# EAGLE design CMoy - OPA1622 (EAGLE 6.4)
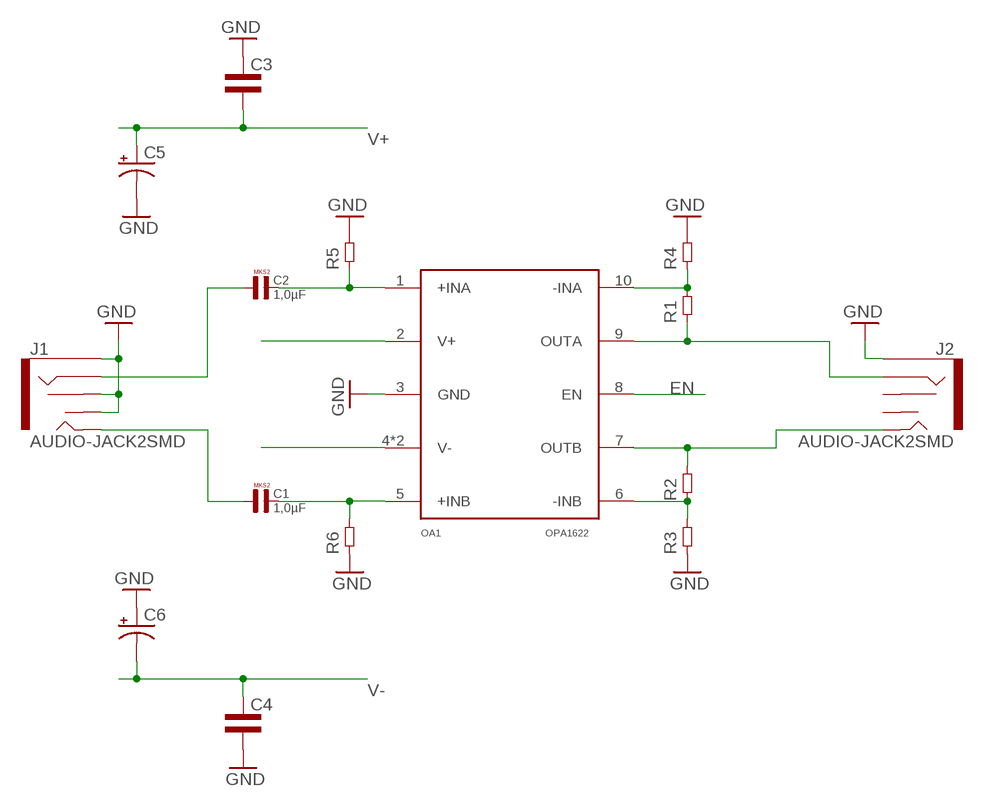
[diagram p0: schematic, sheet 1]

## Parts
C1  1,0µF  [R5B5]
C2  1,0µF  [R5B5]
C3  CAP0402L3  [0402L3]
C4  CAP0402L3  [0402L3]
C5  CPOL-USE5-10.5  [E5-10,5]
C6  CPOL-USE5-10.5  [E5-10,5]
J1  AUDIO-JACK2SMD  [AUDIO-JACK-3.5MM-SMD]
J2  AUDIO-JACK2SMD  [AUDIO-JACK-3.5MM-SMD]
OA1  OPA1622  [S-PVSON-N10]
R1  RES0402L3  [0402L3]
R2  RES0402L3  [0402L3]
R3  RES0402L3  [0402L3]
R4  RES0402L3  [0402L3]
R5  RES0402L3  [0402L3]
R6  RES0402L3  [0402L3]

## Nets
EN: OA1.8(EN)
GND: C3.P$1 C4.P$2 C5.- C6.+ J1.RSH J1.SLEEVE J1.TSH J2.SLEEVE OA1.3(GND) R3.P$1 R4.P$2 R5.P$2 R6.P$1
N$2: C1.2 OA1.5(+INB) R6.P$2
N$3: C2.2 OA1.1(+INA) R5.P$1
N$4: OA1.10(-INA) R1.P$2 R4.P$1
N$5: OA1.6(-INB) R2.P$1 R3.P$2
N$6: J2.TIP OA1.7(OUTB) R2.P$2
N$7: J2.RING OA1.9(OUTA) R1.P$1
N$11: C1.1 J1.TIP
N$12: C2.1 J1.RING
V+: C3.P$2 C5.+ OA1.2(V+)
V-: C4.P$1 C6.- OA1.4(V-) OA1.TP(V-)
Unconnected: J2.RSH J2.TSH

## Library data of the parts
C1 C2 = Capacitor-Wima-MKS2-63v:1,0µF
C3 C4 = common:CAP
C5 C6 = rcl:CPOL-US: POLARIZED CAPACITOR, American symbol
J1 J2 = SparkFun-Connectors:AUDIO-JACK2: Stereo audio jack with bypass switches. Used on LilyPad MP3 board. Production SKU: CONN-10353; PROD_ID: CONN-10353
OA1 = common:OPA1622
R1-R6 = common:RES

## Board
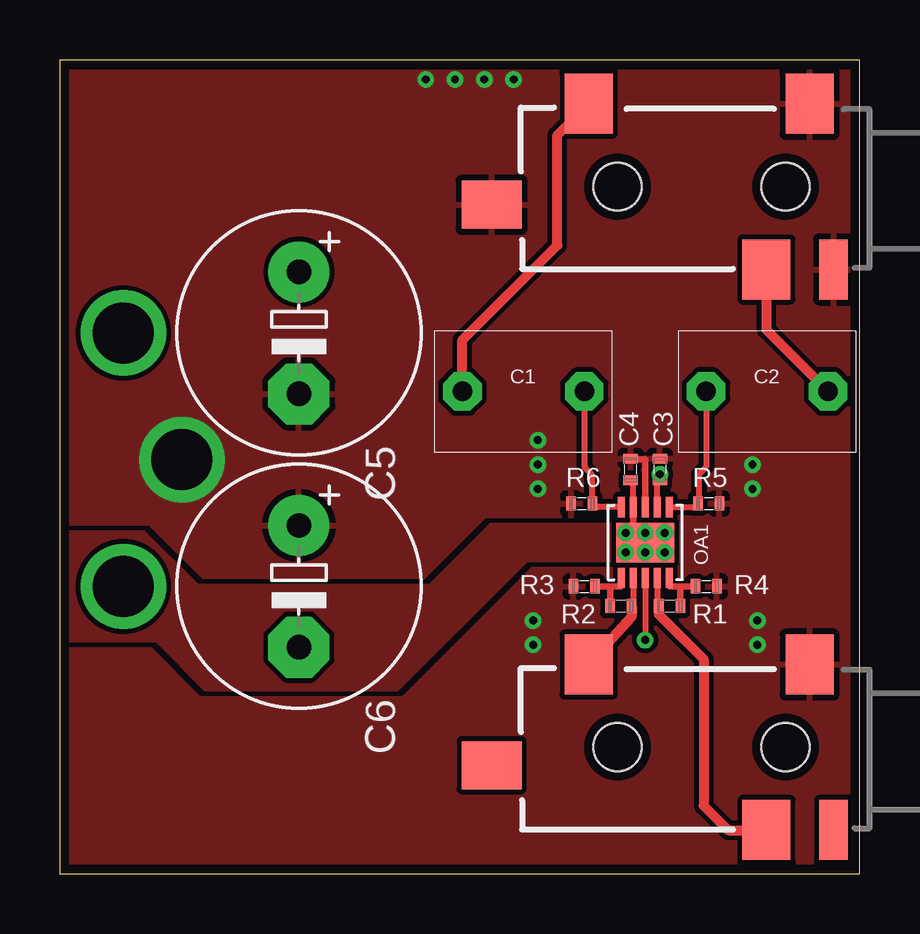
[diagram p1: board, top side]
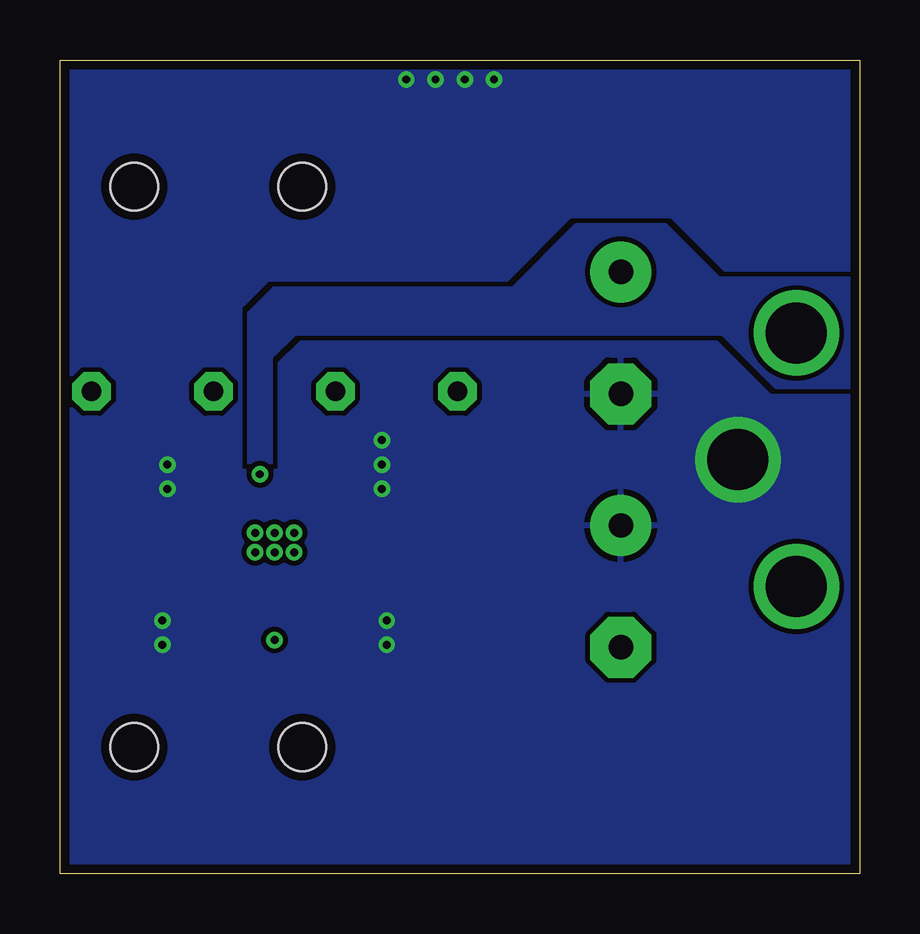
[diagram p2: board, bottom side, seen from below]

Size 33.32 x 33.93 mm. Coordinates in mm from the lower left corner, seen from the top.
Outline: 0,33.93 0,0 33.33,0 33.33,33.93 0,33.93
Copper layers (1*16): Top 0.035mm / dielectric 1.5mm / Bottom 0.035mm
Design rules "default *": minimum track width 8mil, minimum drill 13mil, track to track 8mil, track to pad 8mil, pad to pad 8mil, via to via 8mil, smd to smd 8mil, copper to edge 15mil, drill to drill 8mil, minimum pad ring 7mil, minimum via ring 7mil, stop-mask expansion 4mil, vias tented up to drill 0mil, thermal gap 10mil

### Footprints (pad centres in the part's own frame; a part is rotated, then mirrored left to right if it is on the bottom)
R5B5 = drill 0.813 pad 1.6 octagon: 1 -2.54,0; 2 2.54,0
0402L3 = smd 0.4 x 0.6: P$1 -0.45,0; P$2 0.45,0
E5-10,5 = drill 1.016 pad 2.54: + -2.54,0 | drill 1.016 pad 2.54 octagon: - 2.54,0
AUDIO-JACK-3.5MM-SMD = smd 2 x 2.5: RING 4.3,3.45; SLEEVE 2.5,-3.45; TIP 11.7,-3.45 | smd 1.2 x 2.5: RSH 1.5,3.45 | smd 2.5 x 2: TSH 15.75,0.75 | hole 2: 3.5,0; 10.5,0
S-PVSON-N10 = smd 0.28 x 0.85: 1 -1,-1.475; 2 -0.5,-1.475; 3 0,-1.475; 4 0.5,-1.475; 5 1,-1.475; 6 1,1.475; 7 0.5,1.475; 8 0,1.475; 9 -0.5,1.475; 10 -1,1.475 | smd 2.4 x 1.65: TP 0,0

### Placement (x,y rotation side)
C1  19.3,20.12 0 top
C2  29.46,20.12 180 top
C3  24.99,16.87 270 top
C4  23.77,16.87 90 top
C5  9.96,22.56 270 top
C6  9.96,11.99 270 top
J1  33.73,28.65 180 top
J2  33.73,5.28 180 top
OA1  24.38,13.82 180 top
R1  25.4,11.18 0 top
R2  23.37,11.18 0 top
R3  21.84,11.99 0 top
R4  26.92,11.99 0 top
R5  27.03,15.44 0 top
R6  21.74,15.44 0 top

### Tracks (layer width: path | path; a pad name or v marks a point on that pad's centre or on a via)
EN  (via drill 0.33)
  Top 0.254: OA1.8 v24.38,9.75
GND  (via drill 0.33, 2.54)
  Top 0.279: OA1.3 24.38,17.27 23.82,17.27 C4.P$2
  other vias: 15.24,33.12 16.46,33.12 17.68,33.12 18.9,33.12 5.08,17.27 19.71,10.57 19.91,17.07 28.85,17.07 29.06,10.57 19.71,9.55 29.06,9.55 19.91,18.08 19.91,16.05 28.85,16.05
  pour Top (rank 6): 0.2,33.73 33.12,33.73 33.12,0.2 0.2,0.2
  pour Bottom (rank 6): 0.2,33.73 33.12,33.73 33.12,0.2 0.2,0.2
N$1
  pour Top: 0.2,14.22 3.45,14.22 5.69,11.99 15.44,11.99 17.88,14.43 17.98,14.53 25.5,14.53 25.5,13.11 19.41,13.11 14.02,7.72 6.1,7.72 4.06,9.75 0.2,9.75
N$2
  Top 0.254: OA1.5 22.34,15.29 R6.P$2 22.15,15.49 22.15,16.66 21.84,16.97 C1.2
N$3
  Top 0.254: OA1.1 26.43,15.29 R5.P$1 26.62,15.49 26.62,16.66 26.92,16.97 C2.2
N$4
  Top 0.279: OA1.10 25.38,12 25.4,11.99 25.81,11.99 | 25.81,11.99 R4.P$1 | R1.P$2 25.85,11.95 25.81,11.99
N$5
  Top 0.279: OA1.6 23.38,12 23.37,11.99 22.96,11.99 | 22.96,11.99 R3.P$2 | R2.P$1 22.92,11.95 22.96,11.99
N$6
  Top 0.254: OA1.7 23.88,11.24 R2.P$2
  Top 0.406: J2.TIP 23.82,10.72 R2.P$2
N$7
  Top 0.254: OA1.9 24.88,11.24 R1.P$1
  Top 0.406: R1.P$1 24.95,10.81 26.82,8.94 26.82,2.84 27.84,1.83 29.22,1.83 J2.RING
N$8
  pour Bottom: 0.2,20.32 3.45,20.32 5.69,22.56 23.57,22.56 24.59,21.54 24.59,16.46 24.79,16.26 25.2,16.26 25.4,16.46 25.4,23.37 24.38,24.38 14.43,24.38 11.79,27.03 8.13,27.03 5.89,24.79 0.2,24.79
N$11
  Top 0.406: C1.1 16.76,22.25 20.73,26.21 20.73,30.8 J1.TIP
N$12
  Top 0.406: J1.RING 29.43,22.69 C2.1
V+  (via drill 0.33, 2.54)
  Top 0.254: OA1.2 24.88,16.31 C3.P$2
  Top 0.279: v24.99,16.66 C3.P$2
  other vias: 2.64,22.56
V-  (via drill 0.33, 2.54)
  Top 0.254: OA1.4 23.88,16.31 C4.P$1
  Top 0.279: OA1.4 23.88,14.32 OA1.TP
  other vias: 2.64,11.99 23.57,14.22 24.38,14.22 25.2,14.22 23.57,13.41 24.38,13.41 25.2,13.41